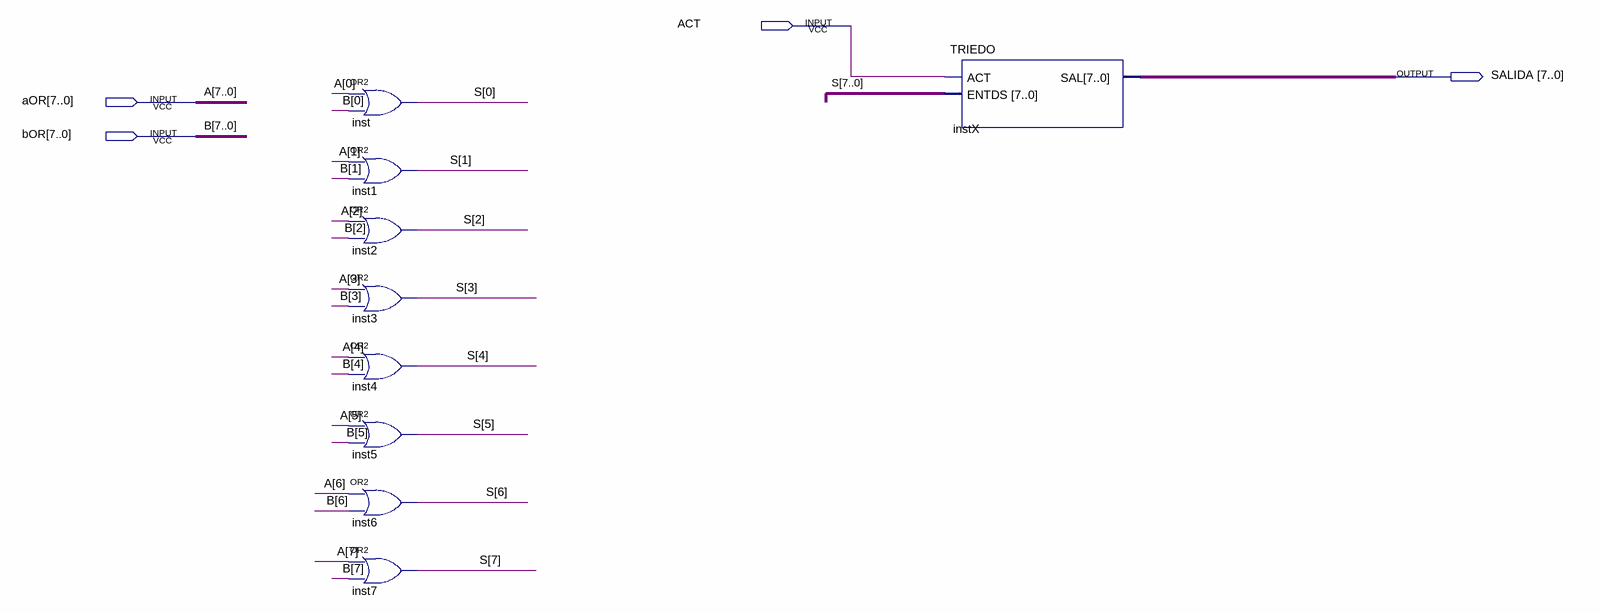
[diagram p0: schematic sheet]
// Quartus schematic OR.bdf as structural Verilog: 9 symbols, 4 pins
module OR (
  input  ACT,
  input  [7:0] aOR,
  input  [7:0] bOR,
  output [7:0] SALIDA
);

  wire [7:0] S;

  or inst (S[0], aOR[0], bOR[0]);
  or inst1 (S[1], aOR[1], bOR[1]);
  or inst2 (S[2], aOR[2], bOR[2]);
  or inst3 (S[3], aOR[3], bOR[3]);
  or inst4 (S[4], aOR[4], bOR[4]);
  or inst5 (S[5], aOR[5], bOR[5]);
  or inst6 (S[6], aOR[6], bOR[6]);
  or inst7 (S[7], aOR[7], bOR[7]);
  TRIEDO instX (.ACT(ACT), .ENTDS(S), .SAL(SALIDA));

  // Other names for the same wires on the sheet: A[7:0] = aOR; B[7:0] = bOR
endmodule
